# EAGLE design Projeto_Relogio_LED (EAGLE 9.6.2)
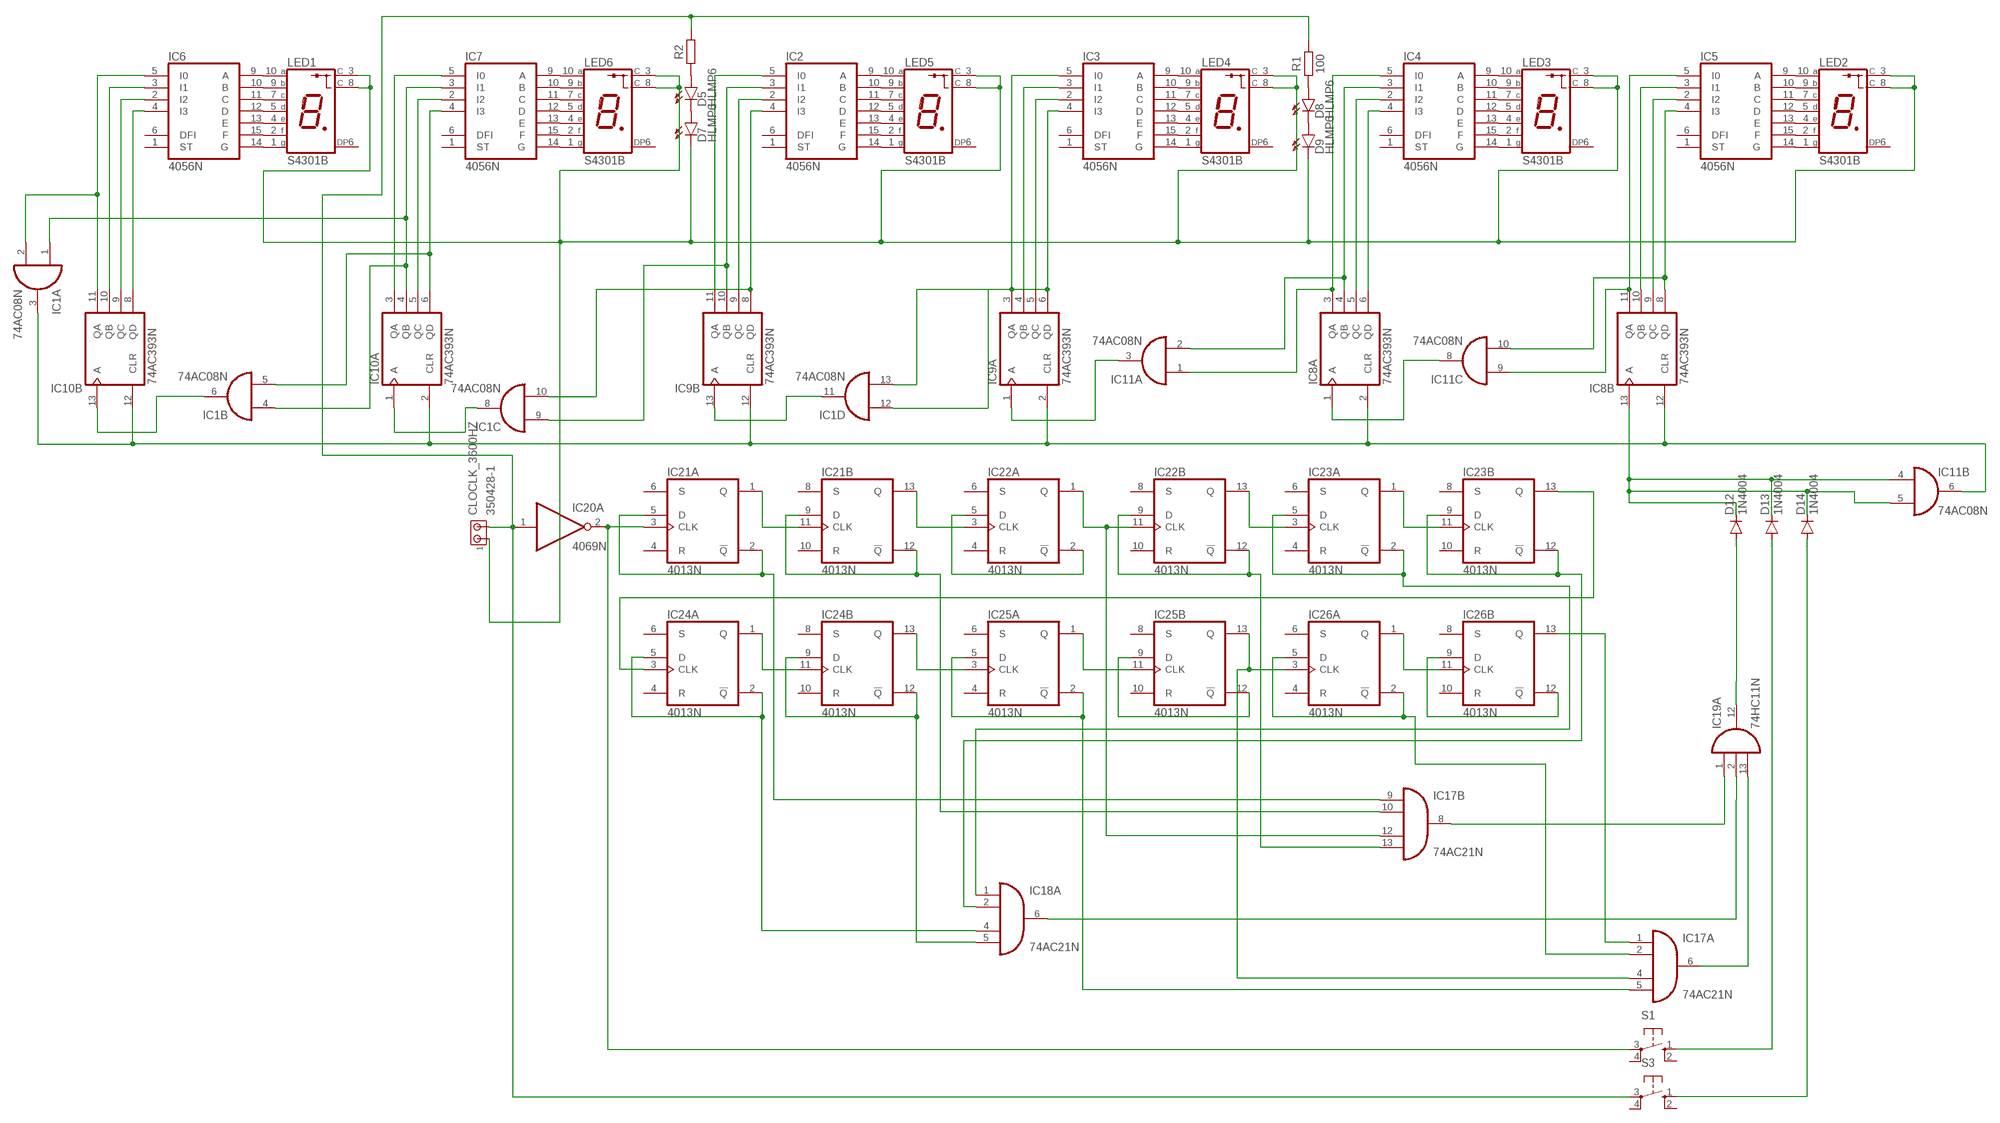
[diagram p0: schematic, sheet 1]

## Parts
CLOCLK_3600HZ  350428-1  [350428-1]
D5  HLMP6  [HLMP6]
D7  HLMP6  [HLMP6]
D8  HLMP6  [HLMP6]
D9  HLMP6  [HLMP6]
D12  1N4004  [DO41-10]
D13  1N4004  [DO41-10]
D14  1N4004  [DO41-10]
IC1  74AC08N  [DIL14]
IC2  4056N  [DIL16]
IC3  4056N  [DIL16]
IC4  4056N  [DIL16]
IC5  4056N  [DIL16]
IC6  4056N  [DIL16]
IC7  4056N  [DIL16]
IC8  74AC393N  [DIL14]
IC9  74AC393N  [DIL14]
IC10  74AC393N  [DIL14]
IC11  74AC08N  [DIL14]
IC17  74AC21N  [DIL14]
IC18  74AC21N  [DIL14]
IC19  74HC11N  [DIL14]
IC20  4069N  [DIL14]
IC21  4013N  [DIL14]
IC22  4013N  [DIL14]
IC23  4013N  [DIL14]
IC24  4013N  [DIL14]
IC25  4013N  [DIL14]
IC26  4013N  [DIL14]
LED1  S4301B  [S4301B]
LED2  S4301B  [S4301B]
LED3  S4301B  [S4301B]
LED4  S4301B  [S4301B]
LED5  S4301B  [S4301B]
LED6  S4301B  [S4301B]
R1  100  RESISTOR_AXIAL-10.16MM-PITCH  [RESAD1016W63L850D250B]
R2  100  RESISTOR_AXIAL-10.16MM-PITCH  [RESAD1016W63L850D250B]
S1  10-XX  [B3F-10XX]
S3  10-XX  [B3F-10XX]

## Nets
N$1: IC1.8(C:O) IC10.1(A:A)
N$2: IC5.4(I3) IC8.8(B:QD) IC11.10(C:I1)
N$3: IC8.1(A:A) IC11.8(C:O)
N$4: D5.A R2.1
N$5: D8.A R1.1
N$6: D12.A IC19.12(A:O)
N$7: IC20.2(A:O) IC21.3(A:CLK) S1.3(P)
N$8: IC21.1(A:Q) IC21.11(B:CLK)
N$9: CLOCLK_3600HZ.2 IC20.1(A:I) R1.2 R2.2 S3.3(P)
N$10: IC21.13(B:Q) IC22.3(A:CLK)
N$11: IC17.12(B:I2) IC22.1(A:Q) IC22.11(B:CLK)
N$12: IC22.13(B:Q) IC23.3(A:CLK)
N$13: IC23.1(A:Q) IC23.11(B:CLK)
N$14: IC24.1(A:Q) IC24.11(B:CLK)
N$15: IC18.4(A:I2) IC24.2(A:!Q) IC24.5(A:D)
N$16: IC24.13(B:Q) IC25.3(A:CLK)
N$17: IC25.1(A:Q) IC25.11(B:CLK)
N$18: IC17.4(A:I2) IC25.13(B:Q) IC26.3(A:CLK)
N$19: IC26.1(A:Q) IC26.11(B:CLK)
N$20: IC23.13(B:Q) IC24.3(A:CLK)
N$21: IC7.14(G) LED6.1(G)
N$22: IC7.15(F) LED6.2(F)
N$23: IC7.13(E) LED6.4(E)
N$24: IC7.12(D) LED6.5(D)
N$25: IC7.11(C) LED6.7(C)
N$26: IC7.10(B) LED6.9(B)
N$27: IC7.9(A) LED6.10(A)
N$28: IC6.9(A) LED1.10(A)
N$29: IC6.10(B) LED1.9(B)
N$30: IC6.11(C) LED1.7(C)
N$31: IC6.12(D) LED1.5(D)
N$32: IC6.13(E) LED1.4(E)
N$33: IC6.15(F) LED1.2(F)
N$34: IC6.14(G) LED1.1(G)
N$35: IC2.14(G) LED5.1(G)
N$36: IC2.15(F) LED5.2(F)
N$37: IC2.13(E) LED5.4(E)
N$38: IC2.12(D) LED5.5(D)
N$39: IC2.11(C) LED5.7(C)
N$40: IC2.10(B) LED5.9(B)
N$41: IC2.9(A) LED5.10(A)
N$42: IC3.9(A) LED4.10(A)
N$43: IC3.10(B) LED4.9(B)
N$44: IC3.11(C) LED4.7(C)
N$45: IC3.12(D) LED4.5(D)
N$46: IC3.13(E) LED4.4(E)
N$47: IC3.15(F) LED4.2(F)
N$48: IC3.14(G) LED4.1(G)
N$49: IC4.14(G) LED3.1(G)
N$50: IC4.15(F) LED3.2(F)
N$51: IC4.13(E) LED3.4(E)
N$52: IC4.12(D) LED3.5(D)
N$53: IC4.11(C) LED3.7(C)
N$54: IC4.10(B) LED3.9(B)
N$55: IC4.9(A) LED3.10(A)
N$56: IC5.14(G) LED2.1(G)
N$57: IC5.15(F) LED2.2(F)
N$58: IC5.13(E) LED2.4(E)
N$59: IC5.12(D) LED2.5(D)
N$60: IC5.11(C) LED2.7(C)
N$61: IC5.10(B) LED2.9(B)
N$62: IC5.9(A) LED2.10(A)
N$63: IC4.4(I3) IC8.6(A:QD)
N$64: IC4.2(I2) IC8.5(A:QC)
N$65: IC4.3(I1) IC8.4(A:QB) IC11.2(A:I1)
N$66: IC4.5(I0) IC8.3(A:QA) IC11.1(A:I0)
N$68: IC5.2(I2) IC8.9(B:QC)
N$69: IC5.3(I1) IC8.10(B:QB)
N$70: IC5.5(I0) IC8.11(B:QA) IC11.9(C:I0)
N$71: IC1.13(D:I1) IC3.4(I3) IC9.6(A:QD)
N$72: IC3.2(I2) IC9.5(A:QC)
N$73: IC3.3(I1) IC9.4(A:QB)
N$74: IC1.12(D:I0) IC3.5(I0) IC9.3(A:QA)
N$75: IC1.10(C:I1) IC2.4(I3) IC9.8(B:QD)
N$76: IC2.2(I2) IC9.9(B:QC)
N$77: IC1.9(C:I0) IC2.3(I1) IC9.10(B:QB)
N$78: IC2.5(I0) IC9.11(B:QA)
N$79: IC1.5(B:I1) IC7.4(I3) IC10.6(A:QD)
N$80: IC7.2(I2) IC10.5(A:QC)
N$81: IC1.1(A:I0) IC1.4(B:I0) IC7.3(I1) IC10.4(A:QB)
N$82: IC7.5(I0) IC10.3(A:QA)
N$83: IC6.4(I3) IC10.8(B:QD)
N$84: IC6.2(I2) IC10.9(B:QC)
N$85: IC6.3(I1) IC10.10(B:QB)
N$86: IC1.2(A:I1) IC6.5(I0) IC10.11(B:QA)
N$87: D5.K D7.A
N$88: D8.K D9.A
N$89: IC17.10(B:I1) IC21.9(B:D) IC21.12(B:!Q)
N$90: IC22.2(A:!Q) IC22.5(A:D)
N$91: IC17.13(B:I3) IC22.9(B:D) IC22.12(B:!Q)
N$92: IC1.6(B:O) IC10.13(B:A)
N$93: IC18.1(A:I0) IC23.2(A:!Q) IC23.5(A:D)
N$94: IC18.2(A:I1) IC23.9(B:D) IC23.12(B:!Q)
N$95: IC18.5(A:I3) IC24.9(B:D) IC24.12(B:!Q)
N$96: IC17.5(A:I3) IC25.2(A:!Q) IC25.5(A:D)
N$97: IC25.9(B:D) IC25.12(B:!Q)
N$99: IC26.9(B:D) IC26.12(B:!Q)
N$100: IC17.9(B:I0) IC21.2(A:!Q) IC21.5(A:D)
N$105: D12.C D13.C D14.C IC8.13(B:A) IC11.4(B:I0) IC11.5(B:I1)
N$106: IC17.8(B:O) IC19.1(A:I0)
N$108: D13.A S1.1(S)
N$109: D14.A S3.1(S)
N$110: IC18.6(A:O) IC19.2(A:I1)
N$111: IC1.3(A:O) IC8.2(A:CLR) IC8.12(B:CLR) IC9.2(A:CLR) IC9.12(B:CLR) IC10.2(A:CLR) IC10.12(B:CLR) IC11.6(B:O)
N$112: IC17.1(A:I0) IC26.13(B:Q)
N$113: CLOCLK_3600HZ.1 D7.K D9.K LED1.3(C) LED1.8(C) LED2.3(C) LED2.8(C) LED3.3(C) LED3.8(C) LED4.3(C) LED4.8(C) LED5.3(C) LED5.8(C) LED6.3(C) LED6.8(C)
N$114: IC9.1(A:A) IC11.3(A:O)
N$115: IC17.2(A:I1) IC26.2(A:!Q) IC26.5(A:D)
N$117: IC1.11(D:O) IC9.13(B:A)
N$124: IC17.6(A:O) IC19.13(A:I2)
Unconnected: IC2.1(ST) IC2.6(DFI) IC3.1(ST) IC3.6(DFI) IC4.1(ST) IC4.6(DFI) IC5.1(ST) IC5.6(DFI) IC6.1(ST) IC6.6(DFI) IC7.1(ST) IC7.6(DFI) IC11.11(D:O) IC11.12(D:I0) IC11.13(D:I1) IC18.8(B:O) IC18.9(B:I0) IC18.10(B:I1) IC18.12(B:I2) IC18.13(B:I3) IC19.3(B:I0) IC19.4(B:I1) IC19.5(B:I2) IC19.6(B:O) IC19.8(C:O) IC19.9(C:I0) IC19.10(C:I1) IC19.11(C:I2) IC20.3(B:I) IC20.4(B:O) IC20.5(C:I) IC20.6(C:O) IC20.8(D:O) IC20.9(D:I) IC20.10(E:O) IC20.11(E:I) IC20.12(F:O) IC20.13(F:I) IC21.4(A:R) IC21.6(A:S) IC21.8(B:S) IC21.10(B:R) IC22.4(A:R) IC22.6(A:S) IC22.8(B:S) IC22.10(B:R) IC23.4(A:R) IC23.6(A:S) IC23.8(B:S) IC23.10(B:R) IC24.4(A:R) IC24.6(A:S) IC24.8(B:S) IC24.10(B:R) IC25.4(A:R) IC25.6(A:S) IC25.8(B:S) IC25.10(B:R) IC26.4(A:R) IC26.6(A:S) IC26.8(B:S) IC26.10(B:R) LED1.6(DP) LED2.6(DP) LED3.6(DP) LED4.6(DP) LED5.6(DP) LED6.6(DP) S1.2(S1) S1.4(P1) S3.2(S1) S3.4(P1)

## Power pins joined to a net without a drawn wire
GND: IC1.7(P:GND) IC2.8(GND) IC3.8(GND) IC4.8(GND) IC5.8(GND) IC6.8(GND) IC7.8(GND) IC8.7(P:GND) IC9.7(P:GND) IC10.7(P:GND) IC11.7(P:GND) IC17.7(P:GND) IC18.7(P:GND) IC19.7(P:GND)
VCC: IC1.14(P:VCC) IC2.16(VCC) IC3.16(VCC) IC4.16(VCC) IC5.16(VCC) IC6.16(VCC) IC7.16(VCC) IC8.14(P:VCC) IC9.14(P:VCC) IC10.14(P:VCC) IC11.14(P:VCC) IC17.14(P:VCC) IC18.14(P:VCC) IC19.14(P:VCC)
VDD: IC20.14(P:VDD) IC21.14(P:VDD) IC22.14(P:VDD) IC23.14(P:VDD) IC24.14(P:VDD) IC25.14(P:VDD) IC26.14(P:VDD)
VEE: IC2.7(VEE) IC3.7(VEE) IC4.7(VEE) IC5.7(VEE) IC6.7(VEE) IC7.7(VEE)
VSS: IC20.7(P:VSS) IC21.7(P:VSS) IC22.7(P:VSS) IC23.7(P:VSS) IC24.7(P:VSS) IC25.7(P:VSS) IC26.7(P:VSS)

## Library data of the parts
CLOCLK_3600HZ = con-amp:350428-1: Universal MATE-N-LOK .250" Centerline, 600 V, 19 - 36 A max Source: http://catalog.tycoelectronics.com/ .. ENG_CD_350428_Y.pdf
D5 D7-D9 = display-hp:HLMP6: LED 2mm horizontal; MF: AGILENT TECHNOLOGIES; MPN: HLMP-6500; OC_FARNELL: 1652490; OC_NEWARK: 40K0088
D12-D14 = diode:1N4004: DIODE general purpose rectifier, 1 A
IC1 IC11 = 74xx-eu:74*08: Quad 2-input AND gate
IC2-IC7 = 40xx:4056: BCD to 7-segment LCD DECODER/DRIVER
IC8-IC10 = 74xx-eu:74*393: Dual 4-bit decade and binary COUNTER
IC17 IC18 = 74xx-eu:74*21: Dual 4-input AND gate
IC19 = 74xx-eu:74*11: Triple 3-input AND gate
IC20 = 40xx:4069: Hex INVERTER
IC21-IC26 = 40xx:4013: Dual D FLIP FLOP, set/reset
LED1-LED6 = led-7-segment:S4301B: Single Digit Seven-Segment Display (cathode common) Source: LITEON .. S4301B.pdf; OC_FARNELL: unknown; OC_NEWARK: unknown
R1 R2 = Tinkercad:RESISTOR: Resistor Fixed - Generic
S1 S3 = switch-omron:10-XX: OMRON SWITCH; MPN: B3F-1000; OC_FARNELL: 176432; OC_NEWARK: 36M3542

## Board
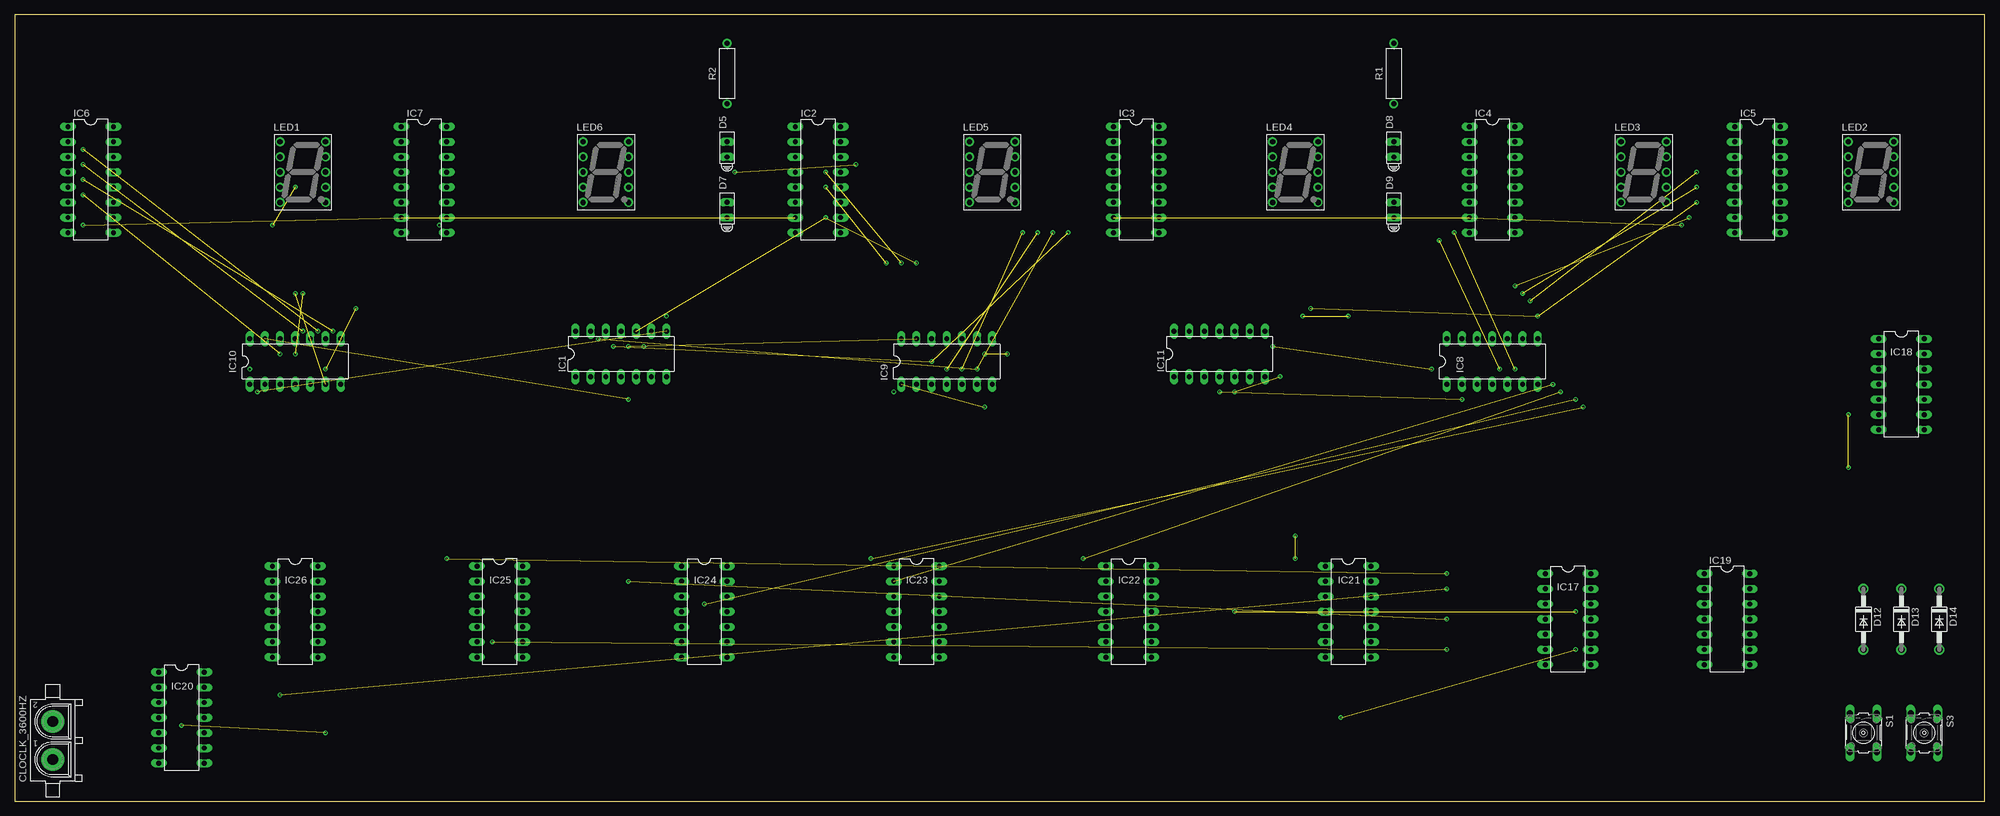
[diagram p1: board, top side]
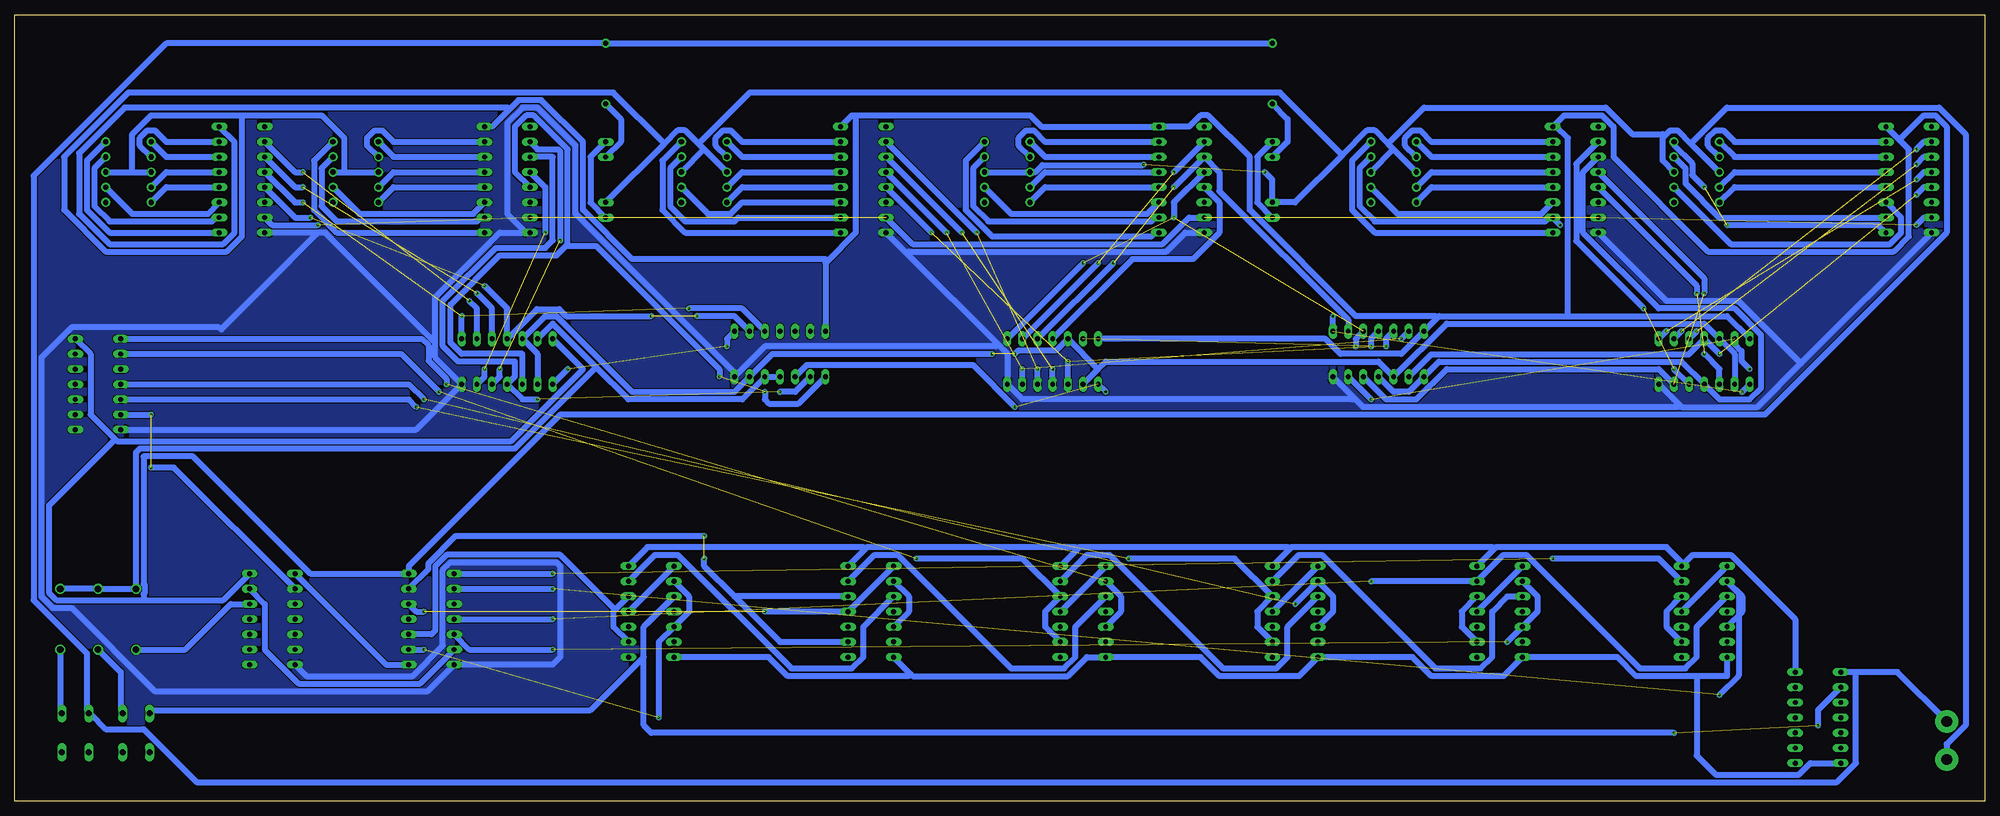
[diagram p2: board, bottom side, seen from below]

Size 330.18 x 131.75 mm. Coordinates in mm from the lower left corner, seen from the top.
Outline: 0,0 330.18,0 330.18,131.75 0,131.75 0,0
Copper layers (1*16): Top 0.035mm / dielectric 1.5mm / Bottom 0.035mm
Design rules "default *": minimum track width 1mm, minimum drill 0.35mm, track to track 6mil, track to pad 6mil, pad to pad 6mil, via to via 6mil, smd to smd 6mil, copper to edge 40mil, drill to drill 6mil, minimum pad ring 10mil, minimum via ring 8mil, stop-mask expansion 4mil, vias tented up to drill 0mil, thermal gap 10mil

### Footprints (pad centres in the part's own frame; a part is rotated, then mirrored left to right if it is on the bottom)
350428-1 = drill 1.8 pad 3.81: 1 -3.175,0; 2 3.175,0
HLMP6 = drill 0.813 long: A -1.27,0; K 1.27,0
DO41-10 = drill 1.118: A 5.08,0; C -5.08,0
DIL14 = drill 0.813 long: 1 -7.62,-3.81; 2 -5.08,-3.81; 3 -2.54,-3.81; 4 0,-3.81; 5 2.54,-3.81; 6 5.08,-3.81; 7 7.62,-3.81; 8 7.62,3.81; 9 5.08,3.81; 10 2.54,3.81; 11 0,3.81; 12 -2.54,3.81; 13 -5.08,3.81; 14 -7.62,3.81
DIL16 = drill 0.813 long: 1 -8.89,-3.81; 2 -6.35,-3.81; 3 -3.81,-3.81; 4 -1.27,-3.81; 5 1.27,-3.81; 6 3.81,-3.81; 7 6.35,-3.81; 8 8.89,-3.81; 9 8.89,3.81; 10 6.35,3.81; 11 3.81,3.81; 12 1.27,3.81; 13 -1.27,3.81; 14 -3.81,3.81; 15 -6.35,3.81; 16 -8.89,3.81
S4301B = drill 0.9 pad 1.5: 1 -3.81,5.08; 2 -3.81,2.54; 3 -3.81,0; 4 -3.81,-2.54; 5 -3.81,-5.08; 6 3.81,-5.08; 7 3.81,-2.54; 8 3.81,0; 9 3.81,2.54; 10 3.81,5.08
RESAD1016W63L850D250B = drill 0.83 pad 1.43: 1 -5.08,0; 2 5.08,0
B3F-10XX = drill 1.016 long: 1 -3.251,2.261; 2 3.251,2.261; 3 -3.251,-2.261; 4 3.251,-2.261

### Placement (x,y rotation side)
CLOCLK_3600HZ  6.35,10.16 90 top
D5  119.38,109.22 90 top
D7  119.38,99.06 90 top
D8  231.14,109.22 90 top
D9  231.14,99.06 90 top
D12  309.88,30.48 270 top
D13  316.23,30.48 270 top
D14  322.58,30.48 270 top
IC1  101.6,74.93 0 top
IC2  134.62,104.14 270 top
IC3  187.96,104.14 270 top
IC4  247.65,104.14 270 top
IC5  292.1,104.14 270 top
IC6  12.7,104.14 270 top
IC7  68.58,104.14 270 top
IC8  247.65,73.66 0 top
IC9  156.21,73.66 0 top
IC10  46.99,73.66 0 top
IC11  201.93,74.93 0 top
IC17  260.35,30.48 270 top
IC18  316.23,69.85 270 top
IC19  287.02,30.48 270 top
IC20  27.94,13.97 270 top
IC21  223.52,31.75 270 top
IC22  186.69,31.75 270 top
IC23  151.13,31.75 270 top
IC24  115.57,31.75 270 top
IC25  81.28,31.75 270 top
IC26  46.99,31.75 270 top
LED1  48.26,105.41 0 top
LED2  311.15,105.41 0 top
LED3  273.05,105.41 0 top
LED4  214.63,105.41 0 top
LED5  163.83,105.41 0 top
LED6  99.06,105.41 0 top
R1  231.14,121.92 90 top
R2  119.38,121.92 90 top
S1  309.88,11.43 270 top
S3  320.04,11.43 270 top

### Tracks (layer width: path | path; a pad name or v marks a point on that pad's centre or on a via)
GND
  Bottom 1: IC19.7 281.31,20.96 263.52,20.96 258.44,26.04 258.44,38.73 257.18,40 239.39,40 238.76,39.37 238.76,24.13 240.03,22.86 IC17.7 260.99,18.41 306.7,18.41 320.68,32.38 323.85,32.38 325.75,34.29 325.75,74.3 320.68,79.38 295.91,79.38 295.59,79.06 279.4,95.25 | 259.72,76.84 259.72,74.3 IC8.7 262.89,62.23 IC18.7 | 259.72,76.84 259.72,84.46 248.92,95.25 IC4.8 244.47,95.25 247.65,98.43 247.65,113.66 245.11,116.21 242.57,116.21 236.22,109.85 236.22,98.43 209.55,71.75 IC11.7 204.47,76.2 165.73,76.2 165.42,76.52 | 279.4,95.25 278.13,95.25 259.72,76.84 | 279.4,95.25 IC5.8 | IC3.8 180.66,91.76 | 180.66,91.76 165.42,76.52 | 165.42,76.52 163.83,74.93 IC9.7 161.29,67.31 106.04,67.31 105.73,67.63 | IC2.8 133.99,95.25 137.16,92.07 180.34,92.07 180.66,91.76 | 30.8,73.34 38.1,66.04 50.8,66.04 51.12,66.36 | 30.8,73.34 IC6.8 | IC10.7 51.12,66.36 | 105.73,67.63 104.14,66.04 51.44,66.04 51.12,66.36 | 105.73,67.63 IC1.7 | IC7.8 53.34,83.82 41.27,83.82 30.8,73.34
  pour Bottom: 1.27,2.54 2.54,1.27 328.93,1.27 328.93,106.68 306.07,129.54 17.78,129.54 1.27,113.03
N$1  (via drill 0.35)  (1 unrouted)
  Bottom 1: IC1.8 v109.22,81.28 | IC10.1 v40.64,68.58
N$2  (via drill 0.35)  (2 unrouted)
  Bottom 1: IC8.8 v255.27,81.28 | IC5.4 283.21,100.33 v281.94,100.33 | IC11.10 208.28,82.55 v217.17,82.55
N$3  (via drill 0.35)  (1 unrouted)
  Bottom 1: IC8.1 v237.49,72.39 | IC11.8 210.82,77.47 v210.82,76.2
N$4
  Bottom 1: D5.A 116.84,110.49 116.84,114.3 R2.1
N$5
  Bottom 1: D8.A 228.6,110.49 228.6,114.3 R1.1
N$6
  Bottom 1: IC19.12 294,33.02 301.62,25.4 D12.A
N$7  (via drill 0.35)  (1 unrouted)
  Bottom 1: 224.79,24.13 224.79,29.21 IC21.3 219.71,34.27 224.22,29.75 | 224.79,24.13 233.68,15.24 307.34,15.24 S1.3 | IC20.2 27.94,15.24 v27.94,12.7 | v52.07,11.43 223.5,11.43 224.79,12.72 224.79,24.13
N$8
  Bottom 1: IC21.1 IC21.11
N$9
  Bottom 1: 21.59,21.59 14.6,21.59 CLOCLK_3600HZ.2 | 21.59,21.59 IC20.1 | R2.2 R1.2 304.8,127 327.02,104.78 327.02,33.66 318.13,24.77 318.13,15.24 S3.3 317.5,14.61 314.96,12.06 308.61,12.06 299.72,3.18 24.76,3.18 21.59,6.35 21.59,21.59
N$10
  Bottom 1: IC22.3 187.96,29.21 187.96,24.13 189.87,22.23 200.03,22.23 219.07,41.27 222.88,41.27 IC21.13
N$11  (via drill 0.35)  (1 unrouted)
  Bottom 1: IC22.1 IC22.11 v204.47,31.75 | IC17.12 262.89,31.75 v261.62,31.75
N$12
  Bottom 1: IC23.3 152.4,29.21 152.4,24.13 154.31,22.23 163.19,22.23 182.25,41.27 186.06,41.27 IC22.13
N$13
  Bottom 1: IC23.1 IC23.11
N$14
  Bottom 1: IC24.1 IC24.11
N$15  (via drill 0.35)  (1 unrouted)
  Bottom 1: IC24.5 109.22,31.75 109.22,34.29 IC24.2 v115.57,33.02 | IC18.4 264.16,69.85 v261.62,67.31
N$16
  Bottom 1: IC25.3 80.01,34.29 82.55,31.75 82.55,24.13 84.45,22.23 92.07,22.23 111.12,41.27 114.94,41.27 IC24.13
N$17
  Bottom 1: IC25.1 IC25.11
N$18  (via drill 0.35)  (1 unrouted)
  Bottom 1: IC26.3 48.26,29.21 48.26,24.13 50.16,22.23 57.78,22.23 76.83,41.27 80.64,41.27 IC25.13 v102.87,36.83 | IC17.4 v240.03,30.48
N$19
  Bottom 1: IC26.1 IC26.11
N$20
  Bottom 1: IC24.3 116.84,29.21 116.84,24.13 118.75,22.23 127.63,22.23 146.69,41.27 150.5,41.27 IC23.13
N$21
  Bottom 1: IC7.14 92.71,107.95 LED6.1
N$22
  Bottom 1: IC7.15 92.71,110.49 94.61,112.4 95.88,112.4 97.16,111.12 97.16,109.85 LED6.2
N$23
  Bottom 1: IC7.13 92.71,105.41 LED6.4
N$24
  Bottom 1: IC7.12 92.71,102.87 LED6.5
N$25
  Bottom 1: IC7.11 74.3,98.43 98.42,98.43 LED6.7
N$26  (via drill 0.35)
  Bottom 1: LED6.9 104.78,106.04 104.78,99.69 102.23,97.16 73.66,97.16 73.02,97.79 IC7.10 v71.12,96.52
N$27
  Bottom 1: IC7.9 102.23,95.25 106.04,99.06 106.04,107.31 LED6.10
N$28  (via drill 0.35)  (1 unrouted)
  Bottom 1: v46.99,102.87 49.01,104.89 49.01,106.88 52.07,109.93 LED1.10 | IC6.9 17.78,96.52 v43.18,96.52
N$29
  Bottom 1: IC6.10 44.45,97.79 50.16,103.5 50.16,106.04 LED1.9
N$30
  Bottom 1: IC6.11 13.97,97.79 13.97,95.25 15.88,93.34 42.55,93.34 LED1.7
N$31
  Bottom 1: IC6.12 41.91,102.87 LED1.5
N$32
  Bottom 1: IC6.13 41.91,105.41 LED1.4
N$33
  Bottom 1: IC6.15 41.91,110.49 43.81,112.4 45.08,112.4 46.36,111.12 46.36,109.85 LED1.2
N$34
  Bottom 1: IC6.14 41.91,107.95 LED1.1
N$35
  Bottom 1: IC2.14 157.48,107.95 LED5.1
N$36
  Bottom 1: IC2.15 157.48,110.49 159.38,112.4 160.66,112.4 161.93,111.12 161.93,109.85 LED5.2
N$37
  Bottom 1: IC2.13 157.48,105.41 LED5.4
N$38
  Bottom 1: IC2.12 157.48,102.87 LED5.5
N$39
  Bottom 1: IC2.11 140.34,98.43 163.19,98.43 LED5.7
N$40
  Bottom 1: IC2.10 139.06,97.79 139.7,97.16 167,97.16 169.54,99.69 169.54,106.04 LED5.9
N$41
  Bottom 1: IC2.9 139.06,95.25 139.7,94.62 166.37,94.62 170.81,99.06 170.81,107.31 LED5.10
N$42
  Bottom 1: IC3.9 217.81,95.25 221.62,99.06 221.62,107.31 LED4.10
N$43
  Bottom 1: IC3.10 208.91,97.79 209.55,97.16 217.81,97.16 220.34,99.69 220.34,106.04 LED4.9
N$44
  Bottom 1: IC3.11 208.28,100.33 210.19,98.43 214,98.43 LED4.7
N$45
  Bottom 1: IC3.12 208.28,102.87 LED4.5
N$46
  Bottom 1: IC3.13 208.28,105.41 LED4.4
N$47
  Bottom 1: IC3.15 208.28,110.49 210.19,112.4 211.45,112.4 212.72,111.12 212.72,109.85 LED4.2
N$48
  Bottom 1: IC3.14 208.28,107.95 LED4.1
N$49
  Bottom 1: IC4.14 266.7,107.95 LED3.1
N$50
  Bottom 1: IC4.15 266.7,110.49 268.61,112.4 269.88,112.4 271.14,111.12 271.14,109.85 LED3.2
N$51
  Bottom 1: IC4.13 266.7,105.41 LED3.4
N$52
  Bottom 1: IC4.12 266.7,102.87 LED3.5
N$53
  Bottom 1: IC4.11 253.37,98.43 272.41,98.43 LED3.7
N$54
  Bottom 1: IC4.10 252.09,97.79 252.73,97.16 276.23,97.16 278.76,99.69 278.76,106.04 LED3.9
N$55
  Bottom 1: IC4.9 276.23,95.25 280.03,99.06 280.03,107.31 LED3.10
N$56
  Bottom 1: IC5.14 304.8,107.95 LED2.1
N$57
  Bottom 1: IC5.15 304.8,110.49 306.7,112.4 307.98,112.4 309.25,111.12 309.25,109.85 LED2.2
N$58
  Bottom 1: IC5.13 304.8,105.41 LED2.4
N$59
  Bottom 1: IC5.12 304.8,102.87 LED2.5
N$60
  Bottom 1: IC5.11 297.81,98.43 310.51,98.43 LED2.7
N$61
  Bottom 1: IC5.10 296.54,97.79 297.18,97.16 314.32,97.16 316.87,99.69 316.87,106.04 LED2.9
N$62
  Bottom 1: IC5.9 314.32,95.25 318.13,99.06 318.13,107.31 LED2.10
N$63  (via drill 0.35)  (1 unrouted)
  Bottom 1: IC8.6 251.46,71.12 v251.46,72.39 | IC4.4 241.3,102.87 v241.3,95.25
N$64  (via drill 0.35)  (1 unrouted)
  Bottom 1: IC8.5 248.92,71.12 v248.92,72.39 | IC4.2 242.57,109.22 239.12,109.22 238.76,108.86 v238.76,93.98
N$65  (via drill 0.35)  (1 unrouted)
  Bottom 1: IC4.3 240.03,107.95 240.03,93.98 241.3,92.71 249.56,92.71 258.44,83.82 258.44,76.2 255.91,73.66 246.38,73.66 246.38,71.12 IC8.4 245.11,67.31 v242.57,67.31 | IC11.2 199.39,68.58 v201.93,68.58
N$66  (via drill 0.35)  (1 unrouted)
  Bottom 1: IC4.5 246.38,105.41 246.38,113.03 244.47,114.94 243.2,114.94 237.49,109.22 237.49,93.34 237.81,93.03 | 237.81,93.03 239.39,91.44 248.92,91.44 257.18,83.19 257.18,76.84 255.27,74.93 245.11,74.93 IC8.3 | 237.81,93.03 232.73,93.03 212.09,72.39 v212.09,71.12 | IC11.1 194.33,71.12 198.85,66.61 203.77,66.61 204.47,67.31 v204.47,68.58
N$68  (via drill 0.35)  (1 unrouted)
  Bottom 1: IC8.9 252.73,82.55 v254,83.82 | IC5.2 283.21,105.41 v281.94,105.41
N$69  (via drill 0.35)  (1 unrouted)
  Bottom 1: IC8.10 250.19,82.55 v252.73,85.09 | IC5.3 283.21,102.87 v281.94,102.87
N$70  (via drill 0.35)  (2 unrouted)
  Bottom 1: v251.46,86.36 247.65,82.55 IC8.11 247.63,77.47 242.66,82.43 238.92,82.43 237.76,81.28 v223.52,81.28 | IC5.5 283.21,97.79 v280.67,97.79 | IC11.9 209.55,81.28 v215.9,81.28
N$71  (via drill 0.35)  (2 unrouted)
  Bottom 1: IC3.4 v173.99,95.25 | IC9.6 v161.29,72.39 | IC1.13 v97.79,77.47
N$72  (via drill 0.35)  (1 unrouted)
  Bottom 1: IC3.2 v168.91,95.25 | IC9.5 v158.75,72.39
N$73  (via drill 0.35)  (1 unrouted)
  Bottom 1: IC3.3 v171.45,95.25 | IC9.4 v156.21,72.39
N$74  (via drill 0.35)  (2 unrouted)
  Bottom 1: IC3.5 v176.53,95.25 | IC9.3 v153.67,73.66 | IC1.12 100.33,77.47 v100.33,76.2
N$75  (via drill 0.35)  (2 unrouted)
  Bottom 1: IC9.8 v151.13,90.17 | IC2.4 135.89,100.33 v135.89,97.79 | IC1.10 105.41,77.47 v105.41,76.2
N$76  (via drill 0.35)  (1 unrouted)
  Bottom 1: IC9.9 v148.59,90.17 | IC2.2 v135.89,105.41
N$77  (via drill 0.35)  (1 unrouted)
  Bottom 1: IC1.9 106.68,80.65 128.27,102.24 128.27,105.41 IC2.3 v135.89,102.87 | IC9.10 v146.05,90.17
N$78
  Bottom 1: IC9.11 142.88,90.81 132.72,90.81 128.27,95.25 128.27,100.33 IC2.5
N$79  (via drill 0.35)  (1 unrouted)
  Bottom 1: IC10.6 54.61,72.39 90.17,72.39 95.25,67.31 100.33,67.31 IC1.5 | IC7.4 46.99,87.63 v46.99,85.09
N$80  (via drill 0.35)  (1 unrouted)
  Bottom 1: IC10.5 v52.07,72.39 | IC7.2 64.77,110.47 68.46,106.78 68.46,93.86 v57.15,82.55
N$81
  Bottom 1: IC7.3 67.31,105.41 67.31,95.25 54.61,82.55 41.91,82.55 37.47,78.1 37.47,69.22 39.37,67.31 44.45,67.31 IC10.4 50.8,73.66 91.44,73.66 IC1.1 96.52,68.58 99.06,68.58 IC1.4
N$82  (via drill 0.35)  (1 unrouted)
  Bottom 1: IC10.3 44.45,72.39 v46.99,74.93 | IC7.5 48.26,86.36 v48.26,85.09
N$83  (via drill 0.35)  (1 unrouted)
  Bottom 1: IC10.8 v53.34,78.74 | IC6.4 10.16,105.41 v11.43,104.14
N$84  (via drill 0.35)  (1 unrouted)
  Bottom 1: IC10.9 v50.8,78.74 | IC6.2 10.16,110.49 v11.43,109.22
N$85  (via drill 0.35)  (1 unrouted)
  Bottom 1: IC10.10 v48.26,78.74 | IC6.3 10.16,107.95 v11.43,106.68
N$86  (via drill 0.35)  (1 unrouted)
  Bottom 1: IC1.2 96.5,71.12 92.81,74.81 49.65,74.81 IC10.11 v44.45,74.93 | IC6.5 10.16,102.87 v11.43,101.6
N$87
  Bottom 1: D7.A 121.92,100.33 121.92,107.95 D5.K
N$88
  Bottom 1: D9.A 233.68,100.33 233.68,107.95 D8.K
N$89
  Bottom 1: IC21.9 229.87,29.21 229.87,31.75 229.55,32.07 | IC21.12 229.55,32.07 | IC17.10 260.35,27.94 259.72,28.58 259.72,39.37 257.81,41.27 238.76,41.27 229.55,32.07
N$90
  Bottom 1: IC22.5 180.34,31.75 180.34,34.29 IC22.2
N$91  (via drill 0.35)  (1 unrouted)
  Bottom 1: 209.55,34.29 201.93,26.67 IC22.9 | IC22.12 209.55,34.29 | 209.55,34.29 214.63,39.37 v214.63,40.64 | IC17.13 260.87,38.85 260.87,39.85 256.26,44.45 v214.63,44.45
N$92  (via drill 0.35)  (1 unrouted)
  Bottom 1: IC1.6 v102.87,67.31 | IC10.13 41.91,76.56 40.76,75.41 40.76,73.78 v39.37,72.39
N$93  (via drill 0.35)  (1 unrouted)
  Bottom 1: IC23.5 144.78,31.75 144.78,34.29 IC23.2 | IC18.1 261.98,77.47 260.87,76.36 260.87,73.82 257.81,70.76 v257.81,69.85
N$94  (via drill 0.35)  (1 unrouted)
  Bottom 1: IC23.9 157.48,29.21 157.48,31.75 IC23.12 161.29,40.64 v179.07,40.64 | IC18.2 265.43,74.93 v259.08,68.58
N$95  (via drill 0.35)  (1 unrouted)
  Bottom 1: IC24.9 121.92,29.21 121.92,31.75 IC24.12 125.73,40.64 v143.51,40.64 | IC18.5 264.16,67.31 v262.89,66.04
N$96  (via drill 0.35)  (1 unrouted)
  Bottom 1: IC25.2 74.93,34.29 74.93,31.75 IC25.5 v80.01,26.67 | IC17.5 254,25.4 v240.03,25.4
N$97
  Bottom 1: IC25.9 87.63,29.21 87.63,31.75 IC25.12
N$99
  Bottom 1: IC26.9 53.34,29.21 53.34,31.75 IC26.12
N$100  (via drill 0.35)  (1 unrouted)
  Bottom 1: IC21.2 217.17,34.29 217.17,31.75 IC21.5 222.25,26.67 v222.25,13.97 | IC17.9 v261.62,25.4
N$105
  Bottom 1: D14.C D13.C D12.C 309.88,58.42 309.25,59.05 246.38,59.05 232.73,72.71 | IC11.4 IC11.5 208.28,67.31 227.33,67.31 232.73,72.71 | IC8.13 240.03,80.01 232.73,72.71
N$106
  Bottom 1: IC17.8 267.97,22.86 IC19.1
N$108
  Bottom 1: D13.A 312.42,21.59 312.42,15.24 S1.1
N$109
  Bottom 1: D14.A 322.58,15.24 S3.1
N$110  (via drill 0.35)  (1 unrouted)
  Bottom 1: IC19.2 303.53,55.88 v307.34,55.88 | IC18.6 v307.34,64.77
N$111  (via drill 0.35)  (1 unrouted)
  Bottom 1: IC8.2 242.57,74.93 IC8.12 241.3,81.28 239.39,81.28 226.69,68.58 209.55,68.58 IC11.6 203.2,74.93 v166.37,74.93 | IC10.2 41.91,74.93 IC10.12 46.99,80.01 90.17,80.01 IC1.3 101.6,73.66 147.32,73.66 148.59,72.39 | IC9.2 148.59,72.39 | 148.59,72.39 IC9.12 153.69,77.47 155.67,75.5 161.99,75.5 v162.56,74.93
N$112  (via drill 0.35)  (1 unrouted)
  Bottom 1: IC26.13 54.61,40.64 v72.39,40.64 | IC17.1 v240.03,38.1
N$113  (via drill 0.35)  (1 unrouted)
  Bottom 1: LED3.8 274.95,105.41 | 274.95,105.41 LED3.3 | LED2.8 310.51,105.41 | 310.51,105.41 LED2.3 | 274.95,105.41 274.95,111.12 278.76,114.94 292.1,114.94 | 292.1,114.94 307.34,114.94 310.51,111.76 310.51,105.41 | 221.3,110.17 219.07,112.4 217.81,112.4 215.58,110.17 | 221.3,110.17 D9.K | LED4.3 214.63,109.22 | 214.63,109.22 215.58,110.17 | 214.63,109.22 LED4.8 | 49.21,110.17 51.44,112.4 52.7,112.4 53.66,111.44 | 49.21,110.17 LED1.3 | 53.66,111.44 53.97,111.12 53.97,107.31 LED1.8 | 107.63,108.27 103.5,112.4 102.23,112.4 100.01,110.17 | 107.63,108.27 115.57,100.33 D7.K 119.38,104.14 v120.65,105.41 | LED6.3 99.06,109.22 | 99.06,109.22 100.01,110.17 | 99.06,109.22 LED6.8 | 100.01,110.17 93.98,116.21 63.5,116.21 59.05,111.76 53.97,111.76 53.66,111.44 | CLOCLK_3600HZ.1 6.35,9.53 3.18,12.7 3.18,111.76 7.62,116.21 43.18,116.21 49.21,110.17 | 215.58,110.17 207.01,118.75 118.11,118.75 107.63,108.27 | 292.1,114.94 292.1,94.62 294.64,92.07 314.96,92.07 321.94,99.06 321.94,107.95 311.15,118.75 229.87,118.75 221.3,110.17 | LED5.8 LED5.3 159.11,105.41 157.96,106.56 141.09,106.56 v140.97,106.68
N$114  (via drill 0.35)  (1 unrouted)
  Bottom 1: IC11.3 199.37,71.12 197.39,73.09 169.61,73.09 v162.56,66.04 | IC9.1 v147.32,68.58
N$115  (via drill 0.35)  (1 unrouted)
  Bottom 1: IC26.5 40.64,31.75 40.64,34.29 IC26.2 43.18,36.81 41.21,34.83 41.21,21.02 v44.45,17.78 | IC17.2 v240.03,35.56
N$117  (via drill 0.35)  (1 unrouted)
  Bottom 1: IC1.11 102.87,77.47 v102.87,76.2
N$124
  Bottom 1: IC17.6 262.25,19.68 282.57,19.68 288.29,25.4 288.29,33.02 IC19.13
VCC
  Bottom 1: 189.23,114.94 189.87,114.94 IC3.16 | 189.23,114.94 160.02,114.94 158.12,113.03 IC2.16 133.35,113.03 131.44,114.94 130.18,114.94 123.19,107.95 123.19,99.06 105.41,81.28 92.07,81.28 91.76,80.96 | IC11.14 194.31,90.17 193.99,90.49 | 193.99,90.49 189.23,95.25 189.23,114.94 | IC4.16 250.19,113.03 247.33,115.89 | 247.33,115.89 245.75,117.47 241.94,117.47 234.95,110.49 234.95,99.06 226.69,90.81 194.31,90.81 193.99,90.49 | IC5.16 293.37,110.49 293.37,95.25 295.27,93.34 314.32,93.34 319.4,98.43 319.4,108.59 311.78,116.21 247.65,116.21 247.33,115.89 | IC8.14 234.95,72.39 247.01,60.33 313.06,60.33 313.37,60.64 | 313.37,60.64 317.5,64.77 317.5,74.93 IC18.14 | IC19.14 295.27,33.66 308.61,33.66 | 308.61,33.66 323.22,33.66 324.49,34.92 324.49,49.53 313.37,60.64 | 14.29,110.81 12.7,109.22 12.7,94.62 15.24,92.07 46.36,92.07 62.23,107.95 62.23,113.03 64.13,114.94 70.48,114.94 IC7.16 71.75,113.03 69.85,111.12 69.85,81.28 | 14.29,110.81 IC6.16 | IC10.14 43.18,81.28 69.85,81.28 | 69.85,81.28 91.44,81.28 91.76,80.96 | 91.76,80.96 IC1.14 97.79,74.93 107.95,74.93 110.49,77.47 IC9.14 | 14.29,110.81 10.16,114.94 8.25,114.94 6.35,113.03 6.35,95.25 36.83,64.77 238.76,64.77 264.16,39.37 IC17.14 280.67,38.1 300.36,57.79 308.61,57.79 308.61,36.4 308.39,36.18 308.39,34.94 308.61,34.72 308.61,33.66
VDD
  Bottom 1: IC20.14 31.75,30.48 42.55,41.27 48.89,41.27 IC26.14 50.8,40 53.34,42.55 81.91,42.55 82.23,42.23 | 82.23,42.23 IC25.14 | 116.52,42.23 116.2,42.55 82.55,42.55 82.23,42.23 | 116.52,42.23 IC24.14 | 152.08,42.23 151.76,42.55 116.84,42.55 116.52,42.23 | 152.08,42.23 IC23.14 | 187.64,42.23 187.32,42.55 152.4,42.55 152.08,42.23 | 187.64,42.23 IC22.14 | IC21.14 224.16,42.55 187.96,42.55 187.64,42.23
VEE  (via drill 0.35)  (4 unrouted)
  Bottom 1: IC2.7 133.35,97.79 137.79,93.34 179.7,93.34 IC3.7 | IC5.7 287.02,96.52 v279.4,96.52 | IC6.7 10.16,97.79 v11.43,96.52
VSS
  Bottom 1: IC22.7 180.02,21.27 | 180.02,21.27 179.7,20.96 153.67,20.96 150.5,24.13 IC23.7 131.44,24.13 128.27,20.96 114.94,20.96 IC24.7 95.88,24.13 92.71,20.96 80.64,20.96 IC25.7 61.59,24.13 58.42,20.96 48.26,20.96 | IC21.7 203.84,24.13 200.66,20.96 180.34,20.96 180.02,21.27 | IC20.7 29.21,6.35 31.11,4.45 45.08,4.45 48.26,7.62 48.26,20.96 | IC26.7 43.18,20.96 48.26,20.96